# Altium schematic sheet PAGE111.SchDoc
size 246 x 182 mm
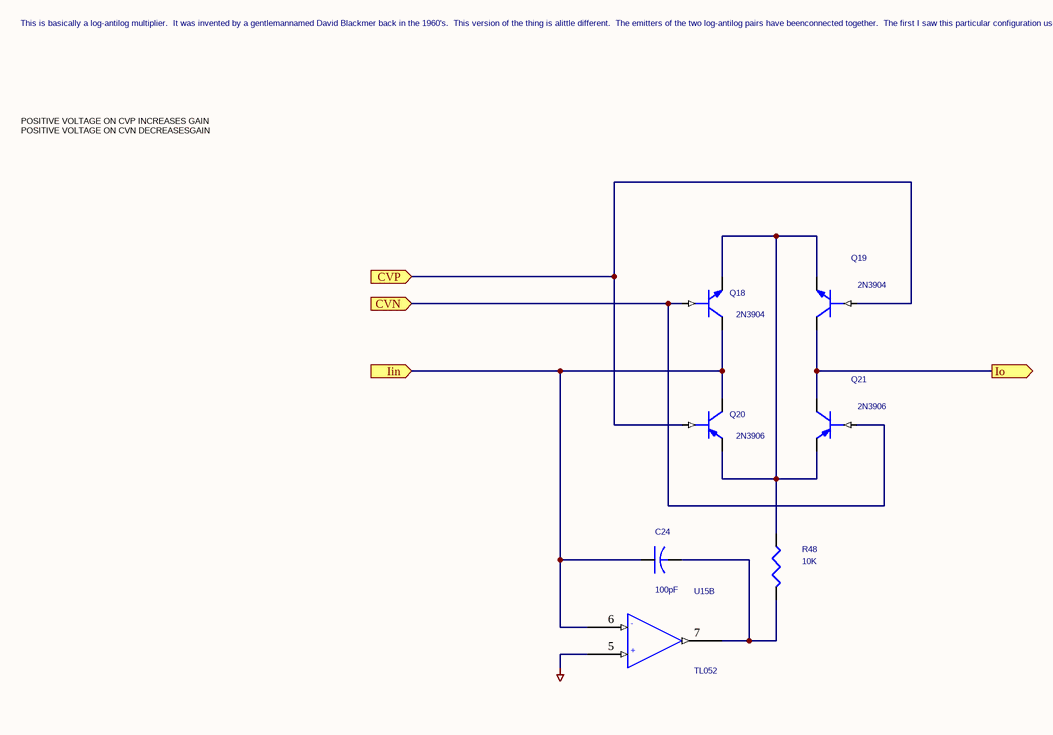
[diagram p0: PAGE111.SchDoc]

## Parts
C24  100pF  [RAD0.1]
Q18  2N3904  [TO92]
Q19  2N3904  [TO92]
Q20  2N3906  [TO92]
Q21  2N3906  [TO92]
R48  10K  [AXIAL0.4]
U15  TL052  [DIP8]  (part B of 3)

## Ports
CVN (in), CVP (in), Iin (in), Io (out)

## Nets
AGND: U15.5(+)
CVN: Q18.BASE Q21.BASE ; port CVN
CVP: Q19.BASE Q20.BASE ; port CVP
Iin: C24.1 Q18.COLLECTOR Q20.COLLECTOR U15.6(-) ; port Iin
Io: Q19.COLLECTOR Q21.COLLECTOR ; port Io
NetC24_2: C24.2 R48.2 U15.7(OUT)
NetQ18_EMITTER: Q18.EMITTER Q19.EMITTER Q20.EMITTER Q21.EMITTER R48.1

## Notes on the sheet
- This is basically a log-antilog multiplier.  It was invented by a gentlemannamed David Blackmer back in the 1960's.  This version of the thing is alittle different.  The emitters of the two log-antilog pairs have beenconnected together.  The first I saw this particular configuration used wasby Jürgen Haible.  It is a very cleaver and useful version of the BlackmerLog-Antilog Multiplier.
- POSITIVE VOLTAGE ON CVP INCREASES GAIN
  POSITIVE VOLTAGE ON CVN DECREASESGAIN

## Library data of the parts
C24 = CAP_Dup1
Q18 Q19 = NPN
Q20 Q21 = PNP
R48 = R_Dup1
U15 = GEN DUAL OPAMP-H: PACKAGE: GLIDE2